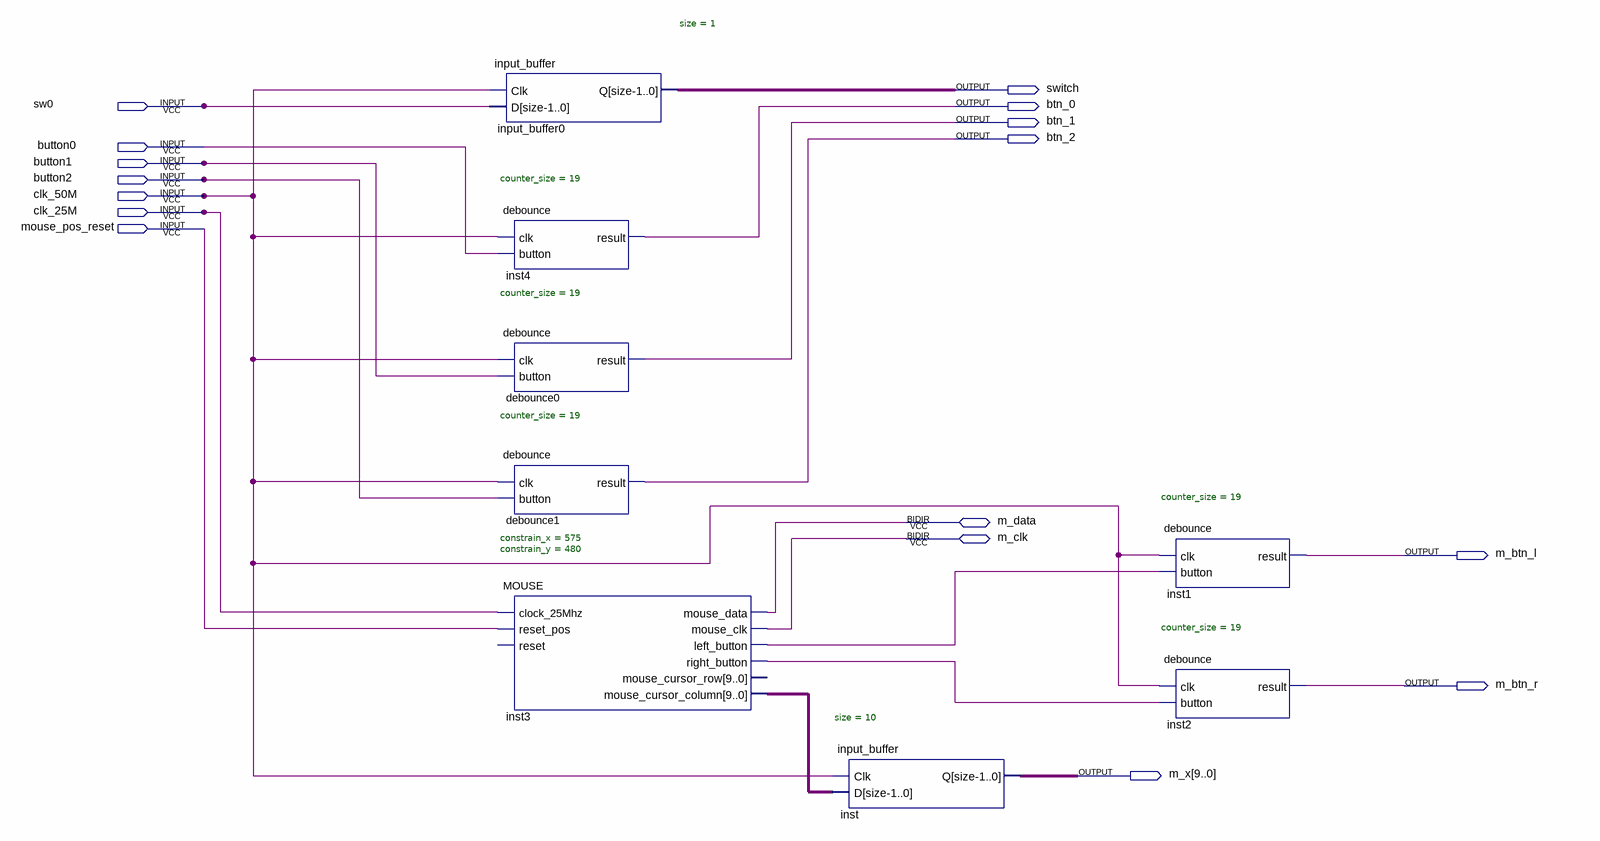
[diagram p0: schematic sheet]
// Quartus schematic input.bdf as structural Verilog: 8 symbols, 16 pins
module \input  (
  input  sw0,
  input  button0,
  input  button1,
  input  button2,
  input  clk_50M,
  input  clk_25M,
  input  mouse_pos_reset,
  inout  m_data,
  inout  m_clk,
  output switch,
  output btn_0,
  output btn_1,
  output btn_2,
  output m_btn_l,
  output m_btn_r,
  output [9:0] m_x
);

  wire inst3_left_button, inst3_right_button;
  wire [9:0] inst3_mouse_cursor_column;

  input_buffer #(.size(1)) input_buffer0 (.Clk(clk_50M), .D(sw0), .Q(switch));
  debounce #(.counter_size(19)) inst4 (.clk(clk_50M), .button(button0), .result(btn_0));
  debounce #(.counter_size(19)) debounce0 (.clk(clk_50M), .button(button1), .result(btn_1));
  debounce #(.counter_size(19)) debounce1 (.clk(clk_50M), .button(button2), .result(btn_2));
  MOUSE #(.constrain_x(575), .constrain_y(480)) inst3 (
    .clock_25Mhz(clk_25M), .reset_pos(mouse_pos_reset), .left_button(inst3_left_button),
    .right_button(inst3_right_button), .mouse_cursor_column(inst3_mouse_cursor_column), .mouse_data(m_data),
    .mouse_clk(m_clk));  // open: reset, mouse_cursor_row
  input_buffer #(.size(10)) inst (.Clk(clk_50M), .D(inst3_mouse_cursor_column), .Q(m_x));
  debounce #(.counter_size(19)) inst1 (.clk(clk_50M), .button(inst3_left_button), .result(m_btn_l));
  debounce #(.counter_size(19)) inst2 (.clk(clk_50M), .button(inst3_right_button), .result(m_btn_r));
endmodule
